# Altium schematic sheet LVPS TX Supply 5V and m5V.SchDoc: LVPS RX Supply 1V8
size 431 x 279 mm; Date: Not shown in title block; ApprovedBy: Not shown in title block; CheckedBy: Not shown in title block; Author: Not shown in title block; CompanyName: Not shown in title block; DrawnBy: Abhishek Vishwa; Engineer: Not shown in title block; Organization: Not shown in title block; Address1: Not shown in title block; Address2: Not shown in title block; Address3: Not shown in title block; Address4: Not shown in title block; DocumentNumber: 1; Revision: Use project parameter SCH_Rev; SheetNumber: 9; SheetTotal: 12; PageSetup: Record=PageOptions|CenterHorizontal=True|CenterVertical=True|PrintScale=1.00|XCorrection=1.00|YCorrection=1.00|PrintKind=0|BorderSize=5000000|LeftOffset=0|BottomOffset=0|Orientation=2|PaperLength=1000|PaperWidth=1000|Scale=100|PaperSource=15|PrintQuality=600|MediaType=1|DitherType=10|PaperKind=Letter|PrintScaleMode=1; CurrentTime: Not shown in title block; CurrentDate: Not shown in title block; Time: Not shown in title block; DocumentFullPathAndName: Not shown in title block; DocumentName: Not shown in title block; ModifiedDate: Not shown in title block; ImagePath: Not shown in title block
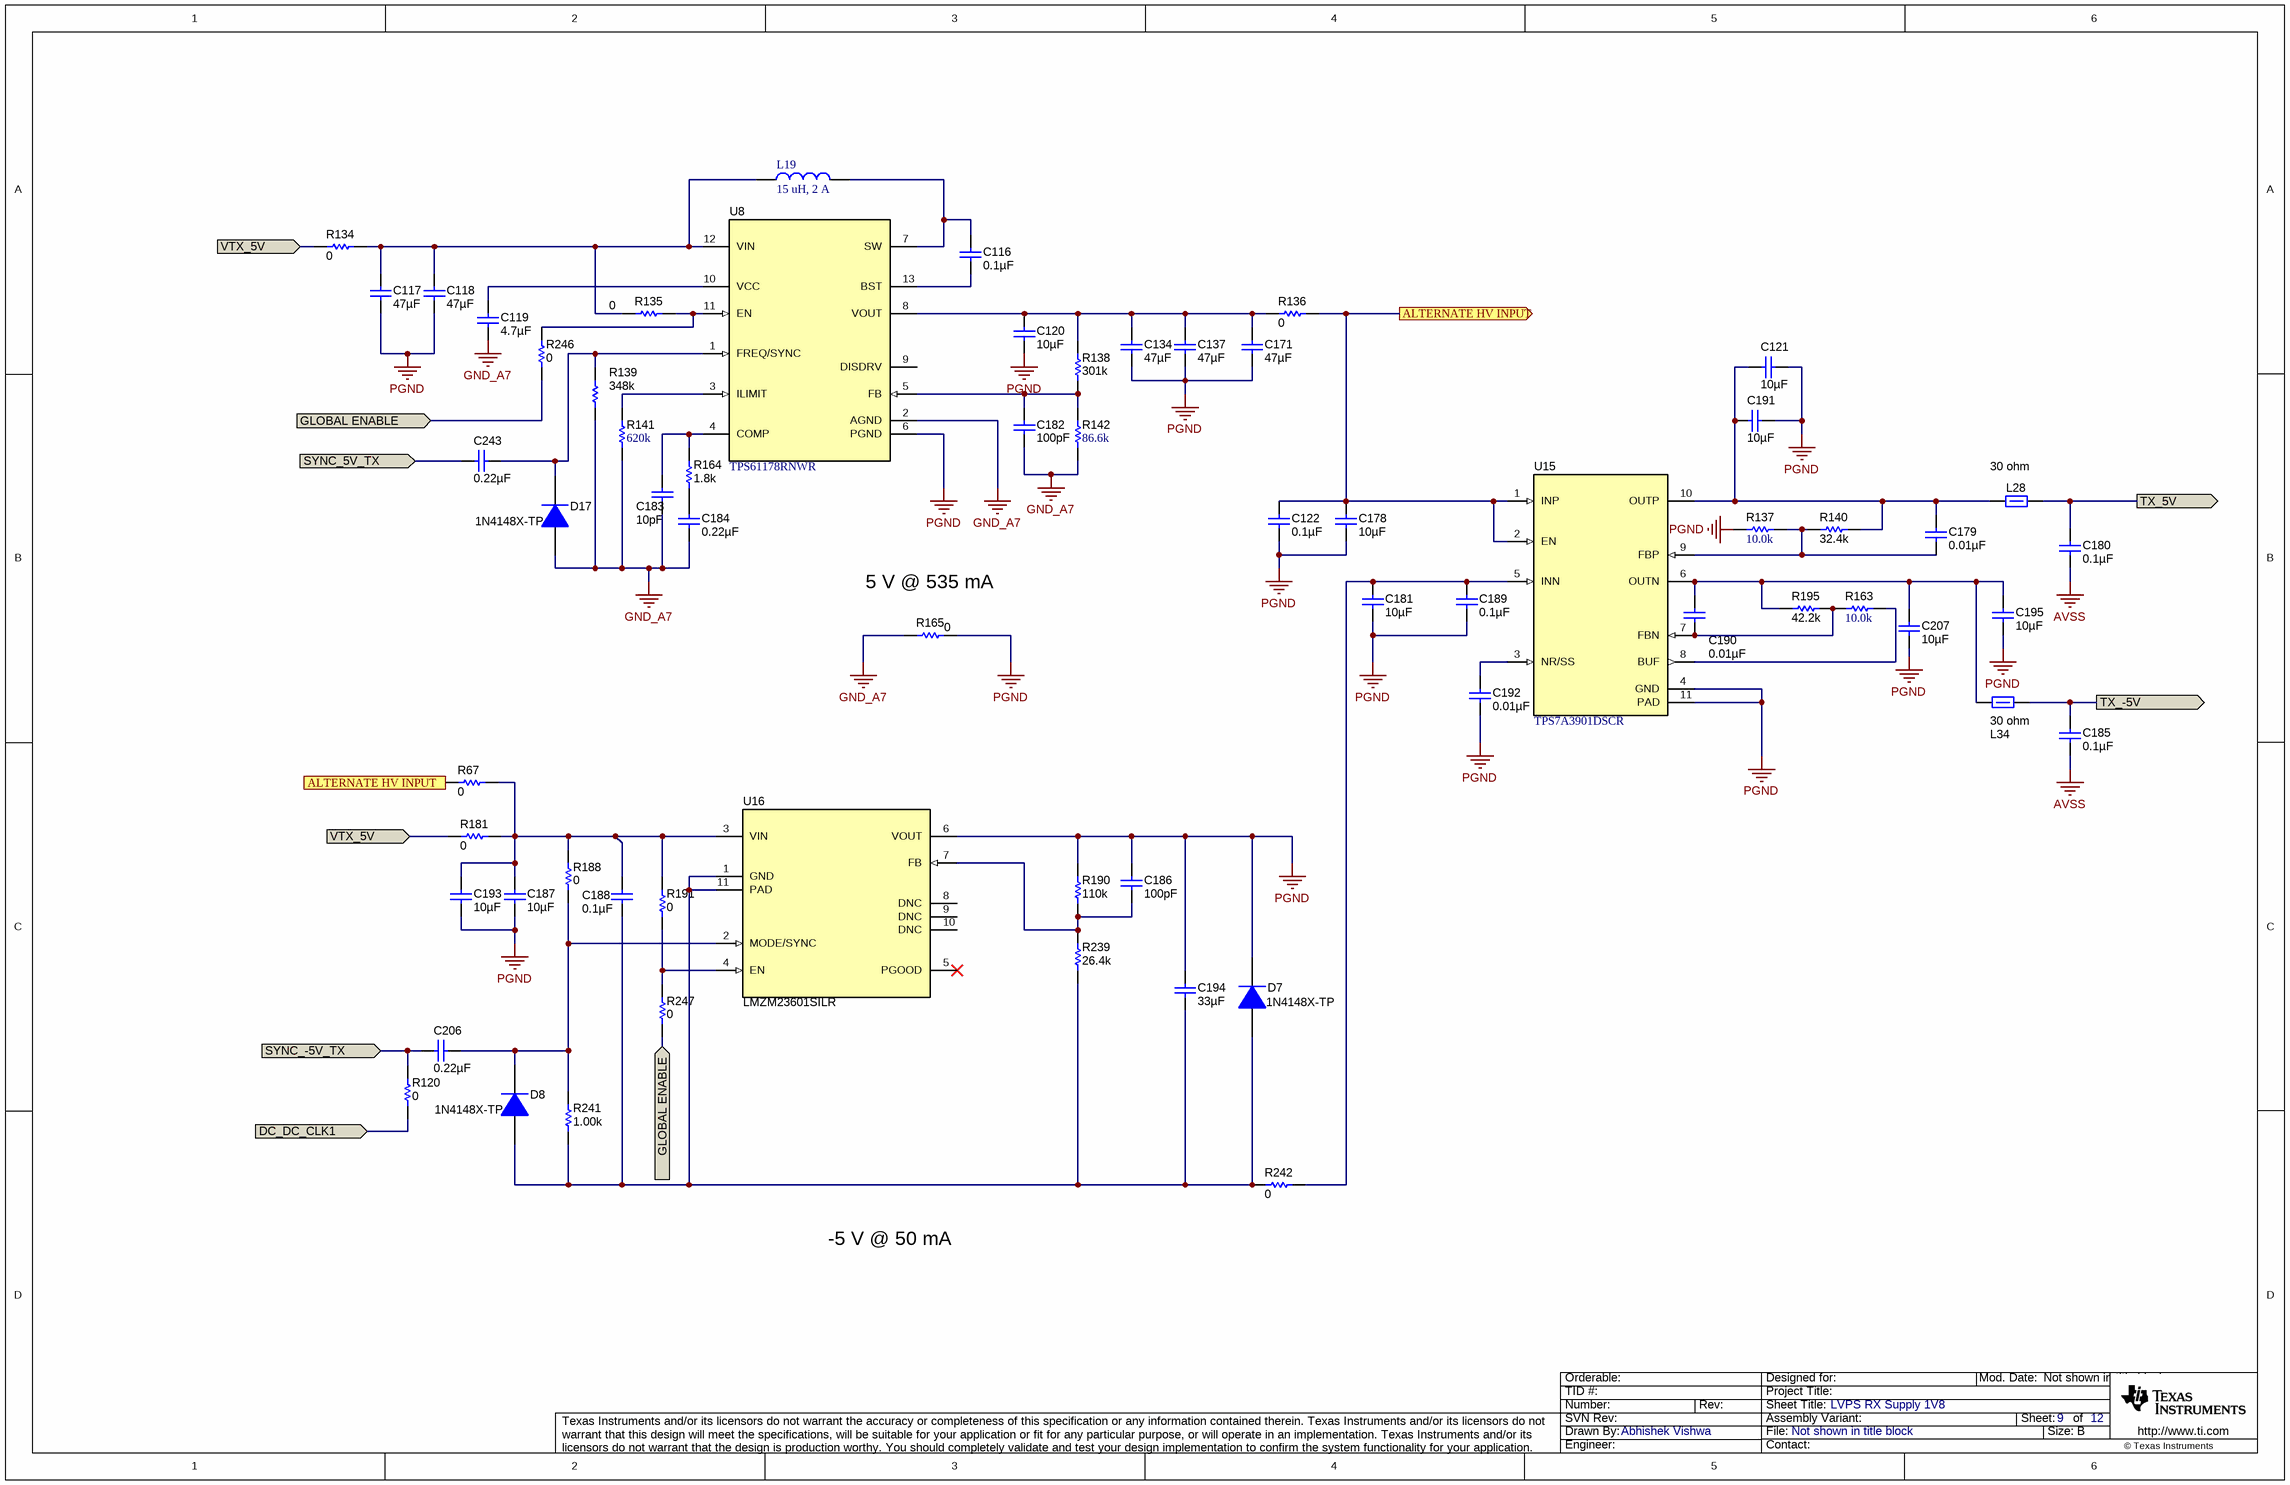
[diagram p0: LVPS TX Supply 5V and m5V.SchDoc]

## Parts
C116  ValueDisplayed: 0.1µF  [0402]  (hidden comment: GRM155R61E104KA87D)
C117  ValueDisplayed: 47µF  [0805_HV]  (hidden comment: GRM21BR61A476ME15)
C118  ValueDisplayed: 47µF  [0805_HV]  (hidden comment: GRM21BR61A476ME15)
C119  ValueDisplayed: 4.7µF  [0603]  (hidden comment: GRM188R61A475MAAJ)
C120  ValueDisplayed: 10µF  [0603]  (hidden comment: GRM188R61C106MAALD)
C121  ValueDisplayed: 10µF  [0603]  (hidden comment: GRM188R61C106MAALD)
C122  ValueDisplayed: 0.1µF  [0402]  (hidden comment: GRM155R61E104KA87D)
C134  ValueDisplayed: 47µF  [0603]  (hidden comment: GRM188R60J476ME15D)
C137  ValueDisplayed: 47µF  [0603]  (hidden comment: GRM188R60J476ME15D)
C171  ValueDisplayed: 47µF  [0603]  (hidden comment: GRM188R60J476ME15D)
C178  ValueDisplayed: 10µF  [0603]  (hidden comment: GRM188R61C106MAALD)
C179  ValueDisplayed: 0.01µF  [0402]  (hidden comment: 885012205031)
C180  ValueDisplayed: 0.1µF  [0402]  (hidden comment: GRM155R61E104KA87D)
C181  ValueDisplayed: 10µF  [0603]  (hidden comment: GRM188R61C106MAALD)
C182  ValueDisplayed: 100pF  [0402]  (hidden comment: 885012005061)
C183  ValueDisplayed: 10pF  [0402]  (hidden comment: GRM1555C1H100FA01D)
C184  ValueDisplayed: 0.22µF  [0402]  (hidden comment: CL05B224KP5NNNC)
C185  ValueDisplayed: 0.1µF  [0402]  (hidden comment: GRM155R61E104KA87D)
C186  ValueDisplayed: 100pF  [0402]  (hidden comment: 885012005061)
C187  ValueDisplayed: 10µF  [0805_HV]  (hidden comment: 885012207026)
C188  ValueDisplayed: 0.1µF  [0603]  (hidden comment: 885012206095)
C189  ValueDisplayed: 0.1µF  [0402]  (hidden comment: GRM155R61E104KA87D)
C190  ValueDisplayed: 0.01µF  [0402]  (hidden comment: 885012205031)
C191  ValueDisplayed: 10µF  [0603]  (hidden comment: GRM188R61C106MAALD)
C192  ValueDisplayed: 0.01µF  [0402]  (hidden comment: 885012205031)
C193  ValueDisplayed: 10µF  [0805_HV]  (hidden comment: 885012207026)
C194  ValueDisplayed: 33µF  [0805_HV]  (hidden comment: C2012X5R1A336M125AC)
C195  ValueDisplayed: 10µF  [0603]  (hidden comment: GRM188R61C106MAALD)
C206  ValueDisplayed: 0.22µF  [0603]  (hidden comment: 885012206048)
C207  ValueDisplayed: 10µF  [0603]  (hidden comment: GRM188R61C106MAALD)
C243  ValueDisplayed: 0.22µF  [0603]  (hidden comment: 885012206048)
D7  1N4148X-TP  [SOD-523]
D8  1N4148X-TP  [SOD-523]
D17  1N4148X-TP  [SOD-523]
L19  15 uH, 2 A  [WE-LQS_5040]
L28  ValueDisplayed: 30 ohm  [0603]  (hidden comment: 742792609)
L34  ValueDisplayed: 30 ohm  [0603]  (hidden comment: 742792609)
R67  ValueDisplayed: 0  [0402]  (hidden comment: ERJ-2GE0R00X)
R120  ValueDisplayed: 0  [0402]  (hidden comment: ERJ-2GE0R00X)
R134  ValueDisplayed: 0  [0603]  (hidden comment: RMCF0603ZT0R00)
R135  ValueDisplayed: 0  [0402]  (hidden comment: ERJ-2GE0R00X)
R136  ValueDisplayed: 0  [0402]  (hidden comment: ERJ-2GE0R00X)
R137  ValueDisplayed: 10.0k  [0603]  (hidden comment: RT0603BRD0710KL)
R138  ValueDisplayed: 301k  [0402]  (hidden comment: ERJ-2RKF3013X)
R139  ValueDisplayed: 348k  [0603]  (hidden comment: ERJ-3EKF3483V)
R140  ValueDisplayed: 32.4k  [0603]  (hidden comment: CRCW060332K4FKEA)
R141  ValueDisplayed: 620k  [CPF0603]  (hidden comment: CPF0603B620KE)
R142  ValueDisplayed: 86.6k  [0402]  (hidden comment: ERA-2AEB8662X)
R163  ValueDisplayed: 10.0k  [0603]  (hidden comment: RT0603BRD0710KL)
R164  ValueDisplayed: 1.8k  [0402]  (hidden comment: ERJ-2GEJ182X)
R165  ValueDisplayed: 0  [0402]  (hidden comment: ERJ-2GE0R00X)
R181  ValueDisplayed: 0  [0402]  (hidden comment: ERJ-2GE0R00X)
R188  ValueDisplayed: 0  [0402]  (hidden comment: ERJ-2GE0R00X)
R190  ValueDisplayed: 110k  [0603]  (hidden comment: ERJ-3EKF1103V)
R191  ValueDisplayed: 0  [0402]  (hidden comment: ERJ-2GE0R00X)
R195  ValueDisplayed: 42.2k  [0603]  (hidden comment: CRCW060342K2FKEA)
R239  ValueDisplayed: 26.4k  [0603]  (hidden comment: RT0603DRE0726K4L)
R241  ValueDisplayed: 1.00k  [0603]  (hidden comment: ERJ-3EKF1001V)
R242  ValueDisplayed: 0  [0402]  (hidden comment: ERJ-2GE0R00X)
R246  ValueDisplayed: 0  [0402]  (hidden comment: ERJ-2GE0R00X)
R247  ValueDisplayed: 0  [0402]  (hidden comment: ERJ-2GE0R00X)
U8  TPS61178RNWR  [RNW0013A]
U15  TPS7A3901DSCR  [DSC0010J]
U16  LMZM23601SILR  [SIL0010A]

## Ports
ALTERNATE HV INPUT (in), ALTERNATE HV INPUT (out), DC_DC_CLK1 (in), GLOBAL ENABLE (in), SYNC_5V_TX (in), SYNC_-5V_TX (in), TX_5V (out), TX_-5V (out), VTX_5V (in)

## Nets
AVSS: C180.1 C185.2
GND_A7: C119.2 C182.1 C183.2 C184.1 D17.2(A) R139.2 R141.1 R142.1 R165.2 U8.2(AGND)
PGND: C117.2 C118.2 C120.2 C121.2 C122.2 C134.2 C137.2 C171.2 C178.2 C181.2 C186.2 C187.2 C189.2 C191.2 C192.1 C193.2 C194.1 C195.1 C207.2 D7.1(K) R137.2 R165.1 R190.2 U8.6(PGND) U15.4(GND) U15.11(PAD) U16.6(VOUT)
ALTERNATE HV INPUT: C122.1 C178.1 R67.1 R136.2 U15.1(INP) U15.2(EN) ; port ALTERNATE HV INPUT
DC_DC_CLK1: R120.2 ; port DC_DC_CLK1
GLOBAL ENABLE: R246.2 R247.2 ; port GLOBAL ENABLE
SYNC_5V_TX: C243.2 ; port SYNC_5V_TX
SYNC_-5V_TX: C206.2 R120.1 ; port SYNC_-5V_TX
TX_5V: C180.2 L28.2 ; port TX_5V
TX_-5V: C185.1 L34.1 ; port TX_-5V
VTX_5V: R134.2 R181.1 ; port VTX_5V
NetC116_1: C116.1 L19.2 U8.7(SW)
NetC116_2: C116.2 U8.13(BST)
NetC117_1: C117.1 C118.1 L19.1 R134.1 R135.2 U8.12(VIN)
NetC119_1: C119.1 U8.10(VCC)
NetC120_1: C120.1 C134.1 C137.1 C171.1 R136.1 R138.2 U8.8(VOUT)
NetC121_1: C121.1 C179.2 C191.1 L28.1 R140.2 U15.10(OUTP)
NetC179_1: C179.1 R137.1 R140.1 U15.9(FBP)
NetC181_1: C181.1 C189.1 R242.2 U15.5(INN)
NetC182_2: C182.2 R138.1 R142.2 U8.5(FB)
NetC183_1: C183.1 R164.2 U8.4(COMP)
NetC184_2: C184.2 R164.1
NetC186_1: C186.1 R190.1 R239.2 U16.7(FB)
NetC187_1: C187.1 C188.1 C193.1 R67.2 R181.2 R188.2 R191.1 U16.3(VIN)
NetC188_2: C188.2 C194.2 D7.2(A) D8.2(A) R239.1 R241.1 R242.1 U16.1(GND) U16.11(PAD)
NetC190_1: C190.1 R163.2 R195.2 U15.7(FBN)
NetC190_2: C190.2 C195.2 C207.1 L34.2 R195.1 U15.6(OUTN)
NetC192_2: C192.2 U15.3(NR/SS)
NetC206_1: C206.1 D8.1(K) R188.1 R241.2 U16.2(MODE/SYNC)
NetC243_1: C243.1 D17.1(K) R139.1 U8.1(FREQ/SYNC)
NetR135_1: R135.1 R246.1 U8.11(EN)
NetR141_2: R141.2 U8.3(ILIMIT)
NetR163_1: R163.1 U15.8(BUF)
NetR191_2: R191.2 R247.1 U16.4(EN)

Not connected (* = marked no-connect by the designer): U8 9(DISDRV); U16 5(PGOOD)* 8(DNC) 9(DNC) 10(DNC)

## Notes on the sheet
- (near R165) 5 V @ 535 mA
- -5 V @ 50 mA
- Drawn By:
- SVN Rev:
- Number:
- TID #:
- Orderable:
- Rev:
- Sheet Title:
- File:
- Project Title:
- Designed for:
- Assembly Variant:
- Mod. Date:
- Sheet:
- Size:
- of
- B
- http://www.ti.com
- Texas Instruments and/or its licensors do not warrant the accuracy or completeness of this specification or any information contained therein. Texas Instruments and/or its licensors do not warrant that this design will meet the specifications, will be suitable for your application or fit for any particular purpose, or will operate in an implementation. Texas Instruments and/or its licensors do not warrant that the design is production worthy. You should completely validate and test your design implementation to confirm the system functionality for your application.
- Engineer:
- Contact:
- © Texas Instruments

## Library data of the parts
C116 C122 C180 C185 C189 = GRM155R61E104KA87D: CAP, CERM, 0.1 µF, 25 V,+/- 10%, X5R, 0402; Manufacturer: MuRata; Polarized: N; CompType: Capacitor; Value: 0.1uF; U/M: EA; Cap_F: 0.0000001; Tolerance_%: 10; VDC_V: 25; Value2: 25V; TaMin_C: -55; TaMax_C: 85; SizeArea_mm2: 0.5; SizeAreaWB_mm2: 3; SizeX_mm: 1; SizeZ_mm: 0.6; AEC Category: Q200; Green_Lifecycle: Active; Green_REACh: Passed; SymbolVersion: 2008-07-09; PartNumber: GRM155R61E104KA87D; PackageReference: 0402; RoHS: Y; MountType: SMT; Technology: Ceramic; TempCo: X5R; Cap_Case: 0402; SizeY_mm: 0.5; Published: 2008-06-19; Publisher: Texas Instruments; LatestRevisionDate: 2017-06-22; ComponentLink1Description: Datasheet link; ComponentLink1URL: http://psearch.murata.com/capacitor/product/GRM155R61E104KA87%23.pdf; Supplier 1: Digi-Key; Supplier Part Number 1: 490-5920-1-ND; Supplier 2: Mouser; Supplier Part Number 2: 81-GRM155R61E104KA7D; AEC Qualified: N; AEC Grade: N/A; Green_EU RoHS: Passed; Green_EU RoHS-2: Passed
C117 C118 = GRM21BR61A476ME15: CAP, CERM, 47 µF, 10 V,+/- 20%, X5R, 0805; Manufacturer: MuRata; Polarized: N; CompType: Capacitor; Value: 47uF; U/M: EA; Cap_F: 0.000047; Tolerance_%: 20; VDC_V: 10; Value2: 10V; TaMin_C: -55; TaMax_C: 85; Cap_Case: 0805; SizeArea_mm2: 2.5; SizeAreaWB_mm2: 6.75; SizeX_mm: 2; SizeY_mm: 1.25; SizeZ_mm: 1.45; AEC Category: Q200; Green_Lifecycle: Active; Green_REACh: Passed; SymbolVersion: 2008-07-09; PartNumber: GRM21BR61A476ME15; PackageReference: 0805; RoHS: Y; MountType: SMT; Technology: Ceramic; TempCo: X5R; Published: 2008-06-19; Publisher: Texas Instruments; LatestRevisionDate: 2017-06-22; ComponentLink1Description: Datasheet link; ComponentLink1URL: http://www.murata.com/~/media/webrenewal/support/library/catalog/products/capacitor/mlcc/c02e.ashx; AEC Qualified: ?; Green_EU RoHS: Passed; Green_EU RoHS-2: Incomplete
C119 = GRM188R61A475MAAJ: CAP, CERM, 4.7 µF, 10 V,+/- 20%, X5R, 0603; Manufacturer: MuRata; Polarized: N; CompType: Capacitor; Value: 4.7uF; U/M: EA; Cap_F: 0.0000047; Tolerance_%: 20; VDC_V: 10; Value2: 10V; TaMin_C: -55; TaMax_C: 85; SizeArea_mm2: 1.28; SizeAreaWB_mm2: 4.68; SizeX_mm: 1.6; SizeY_mm: 0.8; SizeZ_mm: 1; AEC Category: Q200; SymbolVersion: 2008-07-09; PartNumber: GRM188R61A475MAAJ; PackageReference: 0603; RoHS: Y; MountType: SMT; Technology: Ceramic; TempCo: X5R; Cap_Case: 0603; Published: 2008-06-19; Publisher: Texas Instruments; LatestRevisionDate: 2017-06-22; ComponentLink1Description: Datasheet link; ComponentLink1URL: http://psearch.en.murata.com/capacitor/product/GRM188R61A475MAAJ%23.pdf; AEC Qualified: N; AEC Grade: N/A
C120 C121 C178 C181 C191 C195 C207 = GRM188R61C106MAALD: CAP, CERM, 10 µF, 16 V,+/- 20%, X5R, 0603; Manufacturer: MuRata; Polarized: N; CompType: Capacitor; Value: 10uF; U/M: EA; Cap_F: 0.00001; Tolerance_%: 20; VDC_V: 16; Value2: 16V; TaMin_C: -55; TaMax_C: 85; SizeArea_mm2: 1.28; SizeAreaWB_mm2: 4.68; SizeX_mm: 1.6; SizeY_mm: 0.8; SizeZ_mm: 1; AEC Category: Q200; Green_Lifecycle: Active; Green_REACh: Passed; SymbolVersion: 2008-07-09; PartNumber: GRM188R61C106MAALD; PackageReference: 0603; RoHS: Y; MountType: SMT; Technology: Ceramic; TempCo: X5R; Cap_Case: 0603; Published: 2008-06-19; Publisher: Texas Instruments; LatestRevisionDate: 2017-06-22; ComponentLink1Description: Datasheet link; ComponentLink1URL: http://www.murata.com/~/media/webrenewal/support/library/catalog/products/capacitor/mlcc/c02e.ashx; Supplier 1: Digi-Key; Supplier Part Number 1: GRM188R61C106MAALD-ND; Supplier 2: Mouser; Supplier Part Number 2: 81-GRM188R61C106MALD; AEC Qualified: ?; Green_EU RoHS: Passed; Green_EU RoHS-2: Incomplete
C134 C137 C171 = GRM188R60J476ME15D: CAP, CERM, 47 µF, 6.3 V,+/- 20%, X5R, 0603; Manufacturer: MuRata; Polarized: N; CompType: Capacitor; Value: 47uF; U/M: EA; Cap_F: 0.000047; Tolerance_%: 20; VDC_V: 6.3; Value2: 6.3V; TaMin_C: -55; TaMax_C: 85; SizeArea_mm2: 1.28; SizeAreaWB_mm2: 4.68; SizeX_mm: 1.6; SizeY_mm: 0.8; SizeZ_mm: 1; AEC Category: Q200; Green_Lifecycle: Active; Green_REACh: Passed; SymbolVersion: 2008-07-09; PartNumber: GRM188R60J476ME15D; PackageReference: 0603; RoHS: Y; MountType: SMT; Technology: Ceramic; TempCo: X5R; Cap_Case: 0603; Published: 2008-06-19; Publisher: Texas Instruments; LatestRevisionDate: 2017-06-22; ComponentLink1Description: Datasheet link; ComponentLink1URL: http://psearch.en.murata.com/capacitor/product/GRM188R60J476ME15%23.pdf; AEC Qualified: ?; Green_EU RoHS: Passed; Green_EU RoHS-2: Incomplete
C179 C190 C192 = 885012205031: CAP, CERM, 0.01 µF, 16 V,+/- 10%, X7R, 0402; Manufacturer: Wurth Elektronik; Polarized: N; CompType: Capacitor; Value: 0.01uF; U/M: EA; Cap_F: 0.00000001; Tolerance_%: 10; VDC_V: 16; Value2: 16V; TaMin_C: -55; TaMax_C: 125; SizeArea_mm2: 0.5; SizeAreaWB_mm2: 3; SizeX_mm: 1; SizeZ_mm: 0.6; AEC Category: Q200; Green_Lifecycle: Active; Green_REACh: Passed; SymbolVersion: 2008-07-09; PartNumber: 885012205031; PackageReference: 0402; RoHS: Y; MountType: SMT; Technology: Ceramic; TempCo: X7R; Cap_Case: 0402; SizeY_mm: 0.5; Published: 2008-06-19; Publisher: Texas Instruments; LatestRevisionDate: 2017-06-22; ComponentLink1Description: Datasheet link; ComponentLink1URL: http://katalog.we-online.de/pbs/datasheet/885012205031.pdf; Supplier 1: Mouser; Supplier Part Number 1: 710-885012205031; AEC Qualified: N; AEC Grade: N/A; Green_EU RoHS: Passed; Green_EU RoHS-2: Incomplete
C182 C186 = 885012005061: CAP, CERM, 100 pF, 50 V,+/- 5%, C0G/NP0, 0402; Manufacturer: Wurth Elektronik; Polarized: N; CompType: Capacitor; Value: 100pF; U/M: EA; Cap_F: 0.0000000001; Tolerance_%: 5; VDC_V: 50; Value2: 50V; TaMin_C: -55; TaMax_C: 125; SizeArea_mm2: 0.5; SizeAreaWB_mm2: 3; SizeX_mm: 1; SizeZ_mm: 0.6; AEC Category: Q200; Green_Lifecycle: Not Set; Green_REACh: Incomplete; SymbolVersion: 2008-07-09; PartNumber: 885012005061; PackageReference: 0402; RoHS: Y; MountType: SMT; Technology: Ceramic; TempCo: C0G/NP0; Cap_Case: 0402; SizeY_mm: 0.5; Published: 2008-06-19; Publisher: Texas Instruments; LatestRevisionDate: 2017-06-22; ComponentLink1Description: Datasheet link; ComponentLink1URL: http://katalog.we-online.de/pbs/datasheet/885012005061.pdf; Supplier 1: Digi-Key; Supplier Part Number 1: 732-7475-1-ND; Supplier 2: Mouser; Supplier Part Number 2: 710-885012005061; AEC Qualified: N; AEC Grade: N/A; Green_EU RoHS: Incomplete; Green_EU RoHS-2: Incomplete
C183 = GRM1555C1H100FA01D: CAP, CERM, 10 pF, 50 V,+/- 1%, C0G/NP0, 0402; Manufacturer: MuRata; Polarized: N; CompType: Capacitor; Value: 10pF; U/M: EA; Cap_F: 0.00000000001; Tolerance_%: 1; VDC_V: 50; Value2: 50V; TaMin_C: -55; TaMax_C: 125; SizeArea_mm2: 0.5; SizeAreaWB_mm2: 3; SizeZ_mm: 0.6; AEC Category: Q200; SymbolVersion: 2008-07-09; PartNumber: GRM1555C1H100FA01D; PackageReference: 0402; RoHS: Y; MountType: SMT; Technology: Ceramic; TempCo: C0G/NP0; Cap_Case: 0402; SizeX_mm: 1; SizeY_mm: 0.5; Published: 2008-06-19; Publisher: Texas Instruments; LatestRevisionDate: 2017-06-22; ComponentLink1Description: Datasheet link; ComponentLink1URL: http://psearch.en.murata.com/capacitor/product/GRM1555C1H100FA01%23.pdf; Supplier 1: Digi-Key; Supplier Part Number 1: 490-6186-1-ND; Supplier 2: Mouser; Supplier Part Number 2: 81-GRM1555C1H100FA1D; AEC Qualified: N; AEC Grade: N/A
C184 = GRM155R61E104KA87D: CAP CER 0.22UF 10V X7R 0402; Manufacturer: Samsung Electro-Mechanics; Polarized: N; CompType: Capacitor; U/M: EA; Cap_F: 0.0000001; Tolerance_%: 1%; VDC_V: 25; TempCo: X5R; TaMin_C: -55; TaMax_C: 85; SizeArea_mm2: 0.5; SizeAreaWB_mm2: 3; SizeX_mm: 1; SizeZ_mm: 0.6; AEC Category: Q200; Green_Lifecycle: Active; Green_REACh: Passed; SymbolVersion: 2008-07-09; Value: 0.22uF; PartNumber: CL05B224KP5NNNC; PackageReference: 0402; RoHS: Y; Value2: 10V; MountType: SMT; Technology: Ceramic; Cap_Case: 0402; SizeY_mm: 0.5; Published: 2008-06-19; Publisher: Texas Instruments; LatestRevisionDate: 2017-06-22; ComponentLink1Description: Datasheet link; ComponentLink1URL: http://psearch.murata.com/capacitor/product/GRM155R61E104KA87%23.pdf; AEC Qualified: N; AEC Grade: N/A; Green_EU RoHS: Passed; Green_EU RoHS-2: Passed
C187 C193 = 885012207026: CAP, CERM, 10 µF, 10 V,+/- 10%, X7R, 0805; Manufacturer: Wurth Elektronik; Polarized: N; CompType: Capacitor; Value: 10uF; U/M: EA; Cap_F: 0.00001; Tolerance_%: 10; Value2: 10V; TaMin_C: -55; TaMax_C: 125; Cap_Case: 0805; SizeArea_mm2: 2.5; SizeAreaWB_mm2: 6.75; SizeX_mm: 2; SizeY_mm: 1.25; SizeZ_mm: 1.45; AEC Category: Q200; SymbolVersion: 2008-07-09; PartNumber: 885012207026; PackageReference: 0805; RoHS: Y; VDC_V: 10; MountType: SMT; Technology: Ceramic; TempCo: X7R; Published: 2008-06-19; Publisher: Texas Instruments; LatestRevisionDate: 2017-06-22; ComponentLink1Description: Datasheet link; ComponentLink1URL: http://katalog.we-online.de/pbs/datasheet/885012207026.pdf; Supplier 1: Mouser; Supplier Part Number 1: 710-885012207026; AEC Qualified: N; AEC Grade: N/A
C188 = 885012206095: CAP, CERM, 0.1 µF, 50 V,+/- 10%, X7R, 0603; Manufacturer: Wurth Elektronik; Polarized: N; CompType: Capacitor; Value: 0.1uF; U/M: EA; Cap_F: 0.0000001; Tolerance_%: 10; VDC_V: 50; Value2: 50V; TaMin_C: -55; TaMax_C: 125; SizeArea_mm2: 1.28; SizeAreaWB_mm2: 4.68; SizeX_mm: 1.6; SizeY_mm: 0.8; SizeZ_mm: 1; AEC Category: Q200; Green_Lifecycle: Active; Green_REACh: Passed; SymbolVersion: 2008-07-09; PartNumber: 885012206095; PackageReference: 0603; RoHS: Y; MountType: SMT; Technology: Ceramic; TempCo: X7R; Cap_Case: 0603; Published: 2008-06-19; Publisher: Texas Instruments; LatestRevisionDate: 2017-06-22; ComponentLink1Description: Datasheet link; ComponentLink1URL: http://katalog.we-online.de/pbs/datasheet/885012206095.pdf; AEC Qualified: N; AEC Grade: N/A; Green_EU RoHS: Passed; Green_EU RoHS-2: Incomplete
C194 = C2012X5R1A336M125AC: CAP, CERM, 33 µF, 10 V,+/- 20%, X5R, 0805; Manufacturer: TDK; Polarized: N; CompType: Capacitor; Value: 33uF; U/M: EA; Cap_F: 0.000033; Tolerance_%: 20; ESR_ohm: 0.001694; Value1: 0.001694 ohm; VDC_V: 10; Value2: 10V; IRMS_A: 5.01281; TaMin_C: -55; TaMax_C: 85; Cap_Case: 0805; SizeArea_mm2: 2.5; SizeAreaWB_mm2: 6.75; SizeX_mm: 2; SizeY_mm: 1.25; SizeZ_mm: 1.45; AEC Category: Q200; Green_Lifecycle: Active; Green_REACh: Passed; SymbolVersion: 2008-07-09; PartNumber: C2012X5R1A336M125AC; PackageReference: 0805; RoHS: Y; MountType: SMT; Technology: Ceramic; TempCo: X5R; Published: 2008-06-19; Publisher: Texas Instruments; LatestRevisionDate: 2017-06-22; ComponentLink1Description: Datasheet link; ComponentLink1URL: https://product.tdk.com/en/search/capacitor/ceramic/mlcc/info?part_no=C2012X5R1A336M125AC; Supplier 1: Digi-Key; Supplier Part Number 1: 445-8238-1-ND; Supplier 2: Newark; Supplier Part Number 2: 65T7800; AEC Qualified: N; AEC Grade: N/A; Green_EU RoHS: Passed; Green_EU RoHS-2: Passed
C206 C243 = 885012206048: CAP, CERM, 0.22 µF, 16 V,+/- 10%, X7R, 0603; Manufacturer: Wurth Elektronik; Polarized: N; CompType: Capacitor; Value: 0.22uF; U/M: EA; Cap_F: 0.00000022; Tolerance_%: 10; VDC_V: 16; Value2: 16V; TaMin_C: -55; TaMax_C: 125; SizeArea_mm2: 1.28; SizeAreaWB_mm2: 4.68; SizeX_mm: 1.6; SizeY_mm: 0.8; SizeZ_mm: 1; AEC Category: Q200; SymbolVersion: 2008-07-09; PartNumber: 885012206048; PackageReference: 0603; RoHS: Y; MountType: SMT; Technology: Ceramic; TempCo: X7R; Cap_Case: 0603; Published: 2008-06-19; Publisher: Texas Instruments; LatestRevisionDate: 2017-06-22; ComponentLink1Description: Datasheet link; ComponentLink1URL: http://katalog.we-online.de/pbs/datasheet/885012206048.pdf; Supplier 1: Mouser; Supplier Part Number 1: 710-885012206048; AEC Qualified: N; AEC Grade: N/A
D7 D8 D17 = 1N4148X-TP: Diode, Switching, 75 V, 0.3 A, SOD-523; Manufacturer: Micro Commercial Components; U/M: EA; Vf_V: 1.25; Value: 75V; Value1: 0.3A; Value2: 1.25V; Io_A: 0.3; Vr_V: 75; TJmax_C: 150; SizeAreaWB_mm2: 5.13; SizeArea_mm2: 1.53; SizeX_mm: 1.7; SizeY_mm: 0.9; SizeZ_mm: 0.65; AEC Category: Q101; Green_Lifecycle: Not Set; Green_REACh: Incomplete; SymbolVersion: 2008-12-08; PartNumber: 1N4148X-TP; PackageReference: SOD-523; CompType: Diode; MountType: SMT; Type: Switching; RoHS: Y; Published: 2008-06-26; Publisher: Texas Instruments; LatestRevisionDate: 2017-06-26; ComponentLink1Description: Datasheet link; ComponentLink1URL: http://www.mccsemi.com/up_pdf/1N4148X(SOD-523).PDF; Supplier 1: Digi-Key; Supplier Part Number 1: 1N4148XTPMSCT-ND; Supplier 2: Newark; Supplier Part Number 2: 69R6666; Supplier 3: Mouser; Supplier Part Number 3: 833-1N4148X-TP; AEC Qualified: ?; Green_EU RoHS: Incomplete; Green_EU RoHS-2: Incomplete
L19 = 74404054150: SMT Semi-Shielded Power Inductor WE-LQS, size 5040, 15 uH, 2 A; Rated Current: 2 A; Inductance: 15 uH; DC Resistance max.: 103.2 mOhm; Self Resonant Frequency: 22 MHz; Saturation Current: 2.2 A; ComponentLink1Description: Manufacturer; ComponentLink1URL: http://www.we-online.de; ComponentLink2Description: Datasheet; ComponentLink2URL: https://katalog.we-online.de/pbs/datasheet/74404054150.pdf; Part Number: 74404054150; Published Date: November 2018; Publisher: Wurth Elektronik; Size: 5040; Operating Temperature: -40 to +125 degC; Mounting Technology: SMT; Packaging: Tape and Reel
L28 L34 = 742792609: Ferrite Bead, 30 ohm @ 100 MHz, 3 A, 0603; Manufacturer: Wurth Elektronik; Value: 30 ohm; Imax_A: 3; DCR_ohm: 0.04; Value1: 0.04 ohm; Value2: 3A; SizeAreaWB_mm2: 4.68; SizeArea_mm2: 1.28; SizeX_mm: 1.6; SizeY_mm: 0.8; SizeZ_mm: 1; ZTyp@100MHz_Ohm: 30; Ztyp@1GHz_Ohm: 40.472; Green_Lifecycle: Active; Green_REACh: Passed; SymbolVersion: 2017-01-06; PartNumber: 742792609; CompType: Ferrite Bead; MountType: SMT; PackageReference: 0603; Published: 2014-04-30; Publisher: Texas Instruments; LatestRevisionDate: 2017-06-22; ComponentLink1Description: Datasheet link; ComponentLink1URL: http://katalog.we-online.de/pbs/datasheet/742792609.pdf; RoHS: Y; Supplier 1: Digi-Key; Supplier Part Number 1: 732-1591-1-ND; Supplier 2: Mouser; Supplier Part Number 2: 710-742792609; Green_EU RoHS: Passed; Green_EU RoHS-2: Incomplete
R67 R120 R135 R136 R165 R181 R188 R191 R242 R246 R247 = ERJ-2GE0R00X: RES, 0, 5%, 0.063 W, 0402; Manufacturer: Panasonic; CompType: Resistor; Value: 0; Value_Code: 0000; Tolerance_%: 5; Power_W: 0.063; Value2: 0.063W; VDC_V: 50; TempCo: 600 ppm/C; SizeArea_mm2: 0.5; SizeX_mm: 1; SizeZ_mm: 0.6; EIA_Code: E24; U/M: EA; AEC Category: Q200; Green_Lifecycle: Active; Green_REACh: Passed; SymbolVersion: 2009-05-29; PartNumber: ERJ-2GE0R00X; PackageReference: 0402; RoHS: Y; Res_ohm: 0; Value1: 5%; MountType: SMT; Technology: Thick Film; SizeY_mm: 0.5; Published: 2008-06-26; Publisher: Texas Instruments; LatestRevisionDate: 2017-06-12; ComponentLink1Description: Datasheet link; ComponentLink1URL: http://www.panasonic.com/industrial/components/pdf/AOA0000CE1.pdf; Supplier 1: Digi-Key; Supplier Part Number 1: P0.0JCT-ND; Supplier 2: Newark; Supplier Part Number 2: 65T8307; Supplier 3: Mouser; Supplier Part Number 3: 667-ERJ-2GE0R00X; AEC Qualified: ?; Green_EU RoHS: Passed with Exemption; Green_EU RoHS-2: Passed
R134 = RMCF0603ZT0R00: RES, 0, 1%, 0.1 W, AEC-Q200 Grade 0, 0603; Manufacturer: Stackpole Electronics Inc; CompType: Resistor; Value: 0; Tolerance_%: 1; Power_W: 0.1; Value2: 0.1W; TempCo: ppm/C; SizeArea_mm2: 1.28; SizeX_mm: 1.6; SizeY_mm: 0.8; U/M: EA; AEC Category: Q200; AEC Qualified: Y; Green_Lifecycle: Active; Green_REACh: Passed; SymbolVersion: 2009-05-29; PartNumber: RMCF0603ZT0R00; PackageReference: 0603; RoHS: Y; Res_ohm: 0; Value_Code: 0; Value1: 1%; MountType: SMT; Technology: Thick Film; SizeZ_mm: 1; Published: 2008-06-26; Publisher: Texas Instruments; LatestRevisionDate: 2017-06-13; ComponentLink1Description: Datasheet link; ComponentLink1URL: https://www.seielect.com/Catalog/SEI-RMCF_RMCP.pdf; Supplier 1: Digi-Key; Supplier Part Number 1: RMCF0603ZT0R00CT-ND; AEC Grade: 0; Green_EU RoHS: Passed with Exemption; Green_EU RoHS-2: Incomplete
R137 R163 = CMP-0023653-3: RES, 10.0 k, 0.1%, 0.1 W, 0603; Manufacturer: Yageo America; Power_W: 100mW; TempCo: 25 ppm/C; Value_Code: 10k0; U/M: EA; Value: 10.0k; EIA_Code: E192; Res_ohm: 10k; SizeX_mm: 1.6; SizeY_mm: 0.8; SizeZ_mm: 1; Value2: 0.1W; SizeArea_mm2: 1.28; CompType: Resistor; VDC_V: 75V; AEC Category: Q200; Publisher: Texas Instruments; Published: 2008-06-26; RoHS: Y; Value1: 0.1%; MountType: SMT; PackageReference: 0603; Tolerance_%: 0.1%; LatestRevisionDate: 2017-03-09; PartNumber: RT0603BRD0710KL; AEC Qualified: ?; ComponentLink1Description: Datasheet link; Technology: Thin Film; ComponentLink1URL: http://www.yageo.com/pdf/PYu-RT_1-to-0.05_RoHS_L_3.pdf
R138 = CRCW0402301KFKED: RES, 301 k, 1%, 0.063 W, 0402; Manufacturer: Panasonic Electronic Components; CompType: Resistor; Value: 301k; Res_ohm: 301000; Tolerance_%: 1; Power_W: 0.063; Value2: 0.063W; VDC_V: 50; TempCo: 100 ppm/C; SizeArea_mm2: 0.5; SizeZ_mm: 0.6; EIA_Code: E96; U/M: EA; AEC Category: Q200; Green_Lifecycle: Active; Green_REACh: Passed; SymbolVersion: 2009-05-29; PartNumber: ERJ-2RKF3013X; PackageReference: 0402; RoHS: Y; Value_Code: 301k; Value1: 1%; MountType: SMT; Technology: Thick Film; SizeX_mm: 1; SizeY_mm: 0.5; Published: 2008-06-26; Publisher: Texas Instruments; LatestRevisionDate: 2017-06-12; ComponentLink1Description: Datasheet link; ComponentLink1URL: http://www.vishay.com/docs/20035/dcrcwe3.pdf; Supplier 1: Digi-Key; Supplier Part Number 1: P301KLDKR-ND; Supplier 2: Newark; Supplier 3: Mouser; AEC Qualified: ?; Green_EU RoHS: Passed with Exemption; Green_EU RoHS-2: Passed
R139 = RT0603DRE07344KL: RES SMD 348K OHM 1% 1/10W 0603; Manufacturer: Panasonic Electronic Components; CompType: Resistor; Value: 344k; Res_ohm: 344000; Tolerance_%: 0.5; Value1: 0.5%; Power_W: 0.1; Value2: 0.1W; VDC_V: 75; TempCo: 50 ppm/C; SizeArea_mm2: 1.28; SizeX_mm: 1.6; SizeY_mm: 0.8; SizeZ_mm: 1; EIA_Code: E192; U/M: EA; AEC Category: Q200; SymbolVersion: 2009-05-29; PartNumber: ERJ-3EKF3483V; PackageReference: 0603; RoHS: Y; Value_Code: 344k; MountType: SMT; Technology: Thin Film; Published: 2008-06-26; Publisher: Texas Instruments; LatestRevisionDate: 2017-06-13; ComponentLink1Description: Datasheet link; ComponentLink1URL: http://www.yageo.com/pdf/PYu-RT_1-to-0.05_RoHS_L_3.pdf; Supplier Part Number 1: P348KHCT-ND; AEC Qualified: ?
R140 = CRCW060332K4FKEA: RES, 32.4 k, 1%, 0.1 W, 0603; Manufacturer: Vishay-Dale; CompType: Resistor; Value: 32.4k; Res_ohm: 32400; Value_Code: 32k4; Tolerance_%: 1; Power_W: 0.1; Value2: 0.1W; VDC_V: 75; TempCo: 100 ppm/C; SizeArea_mm2: 1.28; SizeX_mm: 1.6; SizeY_mm: 0.8; EIA_Code: E96; U/M: EA; AEC Category: Q200; Green_Lifecycle: Active; Green_REACh: Passed; SymbolVersion: 2009-05-29; PartNumber: CRCW060332K4FKEA; PackageReference: 0603; RoHS: Y; Value1: 1%; MountType: SMT; Technology: Thick Film; SizeZ_mm: 1; Published: 2008-06-26; Publisher: Texas Instruments; LatestRevisionDate: 2017-06-13; ComponentLink1Description: Datasheet link; ComponentLink1URL: http://www.vishay.com/docs/20035/dcrcwe3.pdf; Supplier 1: Digi-Key; Supplier Part Number 1: 541-32.4KHCT-ND; Supplier 2: Newark; Supplier Part Number 2: 52K8423; Supplier 3: Mouser; Supplier Part Number 3: 71-CRCW0603-32.4K-E3; AEC Qualified: ?; Green_EU RoHS: Passed with Exemption; Green_EU RoHS-2: Passed
R141 = CMP-0023355-2: RES SMD 620K OHM 5% 1/10W 0603; Manufacturer: Panasonic Electronic Components; PartNumber: ERJ-3GEYJ624V; Power_W: 63mW; TempCo: 25 ppm/C; Value1: 0.1%; U/M: EA; SizeX_mm: 1.55; SizeY_mm: 0.8; SizeZ_mm: 0.55; Value2: 0.063W; SizeArea_mm2: 1.24; AEC Qualified: N; VDC_V: 50V; AEC Category: Q200; Publisher: Texas Instruments; Supplier 2: Newark; Supplier 3: Mouser; Published: 2008-06-26; Value_Code: 620k; RoHS: Y; MountType: SMT; Value: 620k; Supplier 1: Digi-Key; PackageReference: 0603; Tolerance_%: 0.1%; Res_ohm: 620k; CompType: Resistor; LatestRevisionDate: 2017-03-09; ComponentLink1Description: Datasheet link; AEC Grade: N/A; Supplier Part Number 1: P620KGCT-ND; Technology: Thin Film; ComponentLink1URL: http://www.te.com/commerce/DocumentDelivery/DDEController?Action=srchrtrv&DocNm=1773200&DocType=DS&DocLang=English
R142 = CMP-0026789-1: RES, 86.6 k, 0.1%, 0.063 W, AEC-Q200 Grade 0, 0402; Manufacturer: Panasonic; Power_W: 63mW; TempCo: 25 ppm/C; Value_Code: 86k6; U/M: EA; Value: 86.6k; EIA_Code: E192; SizeX_mm: 1; SizeY_mm: 0.5; SizeZ_mm: 0.6; Value2: 0.063W; AEC Qualified: Y; VDC_V: 50V; AEC Grade: 0; AEC Category: Q200; ComponentLink1URL: https://industrial.panasonic.com/cdbs/www-data/pdf/RDM0000/AOA0000C237.pdf; Supplier Part Number 2: 85Y5630; Publisher: Texas Instruments; Supplier 2: Newark; Supplier Part Number 3: 667-ERA-2AEB8662X; Supplier 3: Mouser; Published: 2008-06-26; RoHS: Y; Value1: 0.1%; MountType: SMT; Supplier 1: Digi-Key; PackageReference: 0402; Tolerance_%: 0.1%; Res_ohm: 86.6k; SizeArea_mm2: 0.5; CompType: Resistor; LatestRevisionDate: 2017-03-09; PartNumber: ERA-2AEB8662X; ComponentLink1Description: Datasheet link; Supplier Part Number 1: P86.6KDCCT-ND; Technology: Thin Film
R164 = CRCW04025K11FKED: RES SMD 1.8K OHM 5% 1/10W 0402; Manufacturer: Panasonic Electronic Components; CompType: Resistor; Res_ohm: 5110; Tolerance_%: 1; Power_W: 0.063; Value2: 0.063W; VDC_V: 50; TempCo: 100 ppm/C; SizeArea_mm2: 0.5; SizeZ_mm: 0.6; EIA_Code: E96; U/M: EA; Green_Lifecycle: Active; Green_REACh: Passed; SymbolVersion: 2009-05-29; Value: 1.8k; PartNumber: ERJ-2GEJ182X; PackageReference: 0402; RoHS: Y; Value_Code: 1.8k; Value1: 5%; MountType: SMT; Technology: Thick Film; SizeX_mm: 1; SizeY_mm: 0.5; Published: 2008-06-26; Publisher: Texas Instruments; LatestRevisionDate: 2017-06-12; ComponentLink1Description: Datasheet link; ComponentLink1URL: http://www.vishay.com/docs/20035/dcrcwe3.pdf; AEC Qualified: ?; Green_EU RoHS-2: Passed
R190 = RG1608P-1023-B-T5: RES SMD 110K OHM 1% 1/10W 0603; Manufacturer: Panasonic Electronic Components; CompType: Resistor; Res_ohm: 102000; Tolerance_%: 0.1; Value2: 0.1W; VDC_V: 75; TempCo: 25 ppm/C; SizeArea_mm2: 1.28; SizeX_mm: 1.6; SizeY_mm: 0.8; SizeZ_mm: 1; EIA_Code: E192; U/M: EA; Green_Lifecycle: Active; Green_REACh: Passed; SymbolVersion: 2009-05-29; Value: 110k; PartNumber: ERJ-3EKF1103V; PackageReference: 0603; RoHS: Y; Value_Code: 110k; Value1: 1%; Power_W: 0.1; MountType: SMT; Technology: Metal Film; Published: 2008-06-26; Publisher: Texas Instruments; ComponentLink1Description: Datasheet link; ComponentLink1URL: http://www.susumu.co.jp/english/pdf/products-j01-01.pdf; AEC Qualified: ?; Green_EU RoHS: Passed; Green_EU RoHS-2: Passed
R195 = CRCW060342K2FKEA: RES, 42.2 k, 1%, 0.1 W, 0603; Manufacturer: Vishay-Dale; CompType: Resistor; Value: 42.2k; Res_ohm: 42200; Value_Code: 42k2; Tolerance_%: 1; Power_W: 0.1; Value2: 0.1W; VDC_V: 75; TempCo: 100 ppm/C; SizeArea_mm2: 1.28; SizeX_mm: 1.6; SizeY_mm: 0.8; EIA_Code: E96; U/M: EA; AEC Category: Q200; Green_Lifecycle: Active; Green_REACh: Passed; SymbolVersion: 2009-05-29; PartNumber: CRCW060342K2FKEA; PackageReference: 0603; RoHS: Y; Value1: 1%; MountType: SMT; Technology: Thick Film; SizeZ_mm: 1; Published: 2008-06-26; Publisher: Texas Instruments; LatestRevisionDate: 2017-06-13; ComponentLink1Description: Datasheet link; ComponentLink1URL: http://www.vishay.com/docs/20035/dcrcwe3.pdf; Supplier 1: Digi-Key; Supplier Part Number 1: 541-42.2KHCT-ND; Supplier 2: Newark; Supplier Part Number 2: 52K8519; Supplier 3: Mouser; Supplier Part Number 3: 71-CRCW0603-42.2K-E3; AEC Qualified: ?; Green_EU RoHS: Passed with Exemption; Green_EU RoHS-2: Passed
R239 = ERA-3AEB2552V: RES SMD 26.4K OHM 1/10W 0603; Manufacturer: Yageo; CompType: Resistor; Res_ohm: 25500; Tolerance_%: 0.1; Value1: 1%; Value2: 0.1W; VDC_V: 75; TempCo: 25 ppm/C; SizeArea_mm2: 1.28; SizeX_mm: 1.6; SizeY_mm: 0.8; SizeZ_mm: 1; EIA_Code: E192; U/M: EA; AEC Qualified: Y; AEC Grade: 0; SymbolVersion: 2009-05-29; Value: 26.4k; PartNumber: RT0603DRE0726K4L; PackageReference: 0603; RoHS: Y; Value_Code: 26.4k; Power_W: 0.1; MountType: SMT; Technology: Thin Film; Published: 2008-06-26; Publisher: Texas Instruments; LatestRevisionDate: 2017-06-13; ComponentLink1Description: Datasheet link; ComponentLink1URL: http://industrial.panasonic.com/lecs/www-data/pdf/AOA0000/AOA0000CE26.pdf
R241 = ERJ-3EKF1001V: RES, 1.00 k, 1%, 0.1 W, AEC-Q200 Grade 0, 0603; Manufacturer: Panasonic; CompType: Resistor; Value: 1.00k; Res_ohm: 1000; Value_Code: 1k00; Tolerance_%: 1; Power_W: 0.1; Value2: 0.1W; VDC_V: 75; TempCo: 100 ppm/C; SizeArea_mm2: 1.28; SizeX_mm: 1.6; SizeY_mm: 0.8; EIA_Code: E96; U/M: EA; AEC Category: Q200; AEC Qualified: Y; AEC Grade: 0; Green_Lifecycle: Active; Green_REACh: Passed; SymbolVersion: 2009-05-29; PartNumber: ERJ-3EKF1001V; PackageReference: 0603; RoHS: Y; Value1: 1%; MountType: SMT; Technology: Thick Film; SizeZ_mm: 1; Published: 2008-06-26; Publisher: Texas Instruments; LatestRevisionDate: 2017-06-13; ComponentLink1Description: Datasheet link; ComponentLink1URL: https://industrial.panasonic.com/cdbs/www-data/pdf/RDA0000/AOA0000C283.pdf; Supplier 1: Digi-Key; Supplier Part Number 1: P1.00KHCT-ND; Supplier 2: Newark; Supplier Part Number 2: 64R5308; Supplier 3: Mouser; Supplier Part Number 3: 667-ERJ-3EKF1001V; Green_EU RoHS: Passed with Exemption; Green_EU RoHS-2: Passed
U8 = CMP-0013943-2: 20 Vout Fully Integration Synchronous Boost Converter with 8 A Switch Current, RNW0013A (VQFN-HR-13); Manufacturer: Texas Instruments; Alternate PartNumber: TPS61178RNWT; SizeX_mm: 3.5; SizeY_mm: 3; CompType: IC; SizeZ_mm: 1; SizeArea_mm2: 10.5; SizeAreaWB_mm2: 18; U/M: EA; PackageDescription: VQFN-HR-13; PartNumber: TPS61178RNWR; ComponentLink1URL: https://sps06.itg.ti.com/sites/KMS/crossdivteams/altium/docs/ComponentDatasheets/TPS61178_0120.pdf; ComponentLink1Description: Datasheet Link; LatestRevisionDate: 2017-03-09; Publisher: Texas Instruments; PackageReference: RNW0013A; MountType: SMT; Alternate Manufacturer: Texas Instruments
U15 = CMP-0013435-7: Dual, 150mA, Wide-Vin, Positive and Negative Low-Dropout (LDO) Voltage Regulator, DSC0010J (WSON-10); Alternate Manufacturer: Texas Instruments; Alternate PartNumber: TPS7A3901DSCT; Rating: Catalog; CompType: IC; SizeAreaWB_mm2: 16.0; SizeY_mm: 3.0; AEC Qualified: N; SizeZ_mm: 0.8; SizeArea_mm2: 9.0; AEC Category: Q200; PackageDescription: WSON-10; RoHS: Y; PackageReference: DSC0010J; ComponentLink2Description: Product Folder; ComponentLink3Description: Online Datasheet; Operating Temperature Range: -40 to 125 C; PartNumber: TPS7A3901DSCR; Manufacturer: Texas Instruments; ComponentLink3URL: http://www.ti.com/product/tps7a39/datasheet; MountType: SMT; ComponentLink1Description: Datasheet Link; SizeX_mm: 3.0; ComponentLink2URL: http://www.ti.com/product/tps7a39; ComponentLink1URL: http://www.ti.com/lit/ds/symlink/tps7a39.pdf
U16 = CMP-0065261-6: 36-V 1-A Step-Down DC-DC Nano Module, SIL0010A (uSIP-10); Manufacturer: Texas Instruments; Alternate PartNumber: LMZM23601SILT; SizeX_mm: 3.8; SizeY_mm: 3.0; CompType: IC; SizeZ_mm: 1.578; SizeArea_mm2: 11.4; SizeAreaWB_mm2: 19.2; AEC Category: Q200; AEC Qualified: N; PackageDescription: uSIP-10; PartNumber: LMZM23601SILR; ComponentLink1URL: http://www.ti.com/lit/ds/symlink/lmzm23601.pdf; ComponentLink1Description: Datasheet Link; PackageReference: SIL0010A; MountType: SMT; Alternate Manufacturer: Texas Instruments; ComponentLink2Description: Product Folder; ComponentLink2URL: http://www.ti.com/product/lmzm23601; ComponentLink3Description: Online Datasheet; ComponentLink3URL: http://www.ti.com/product/lmzm23601/datasheet